# EAGLE design shieldie-xbee (EAGLE 6.4)
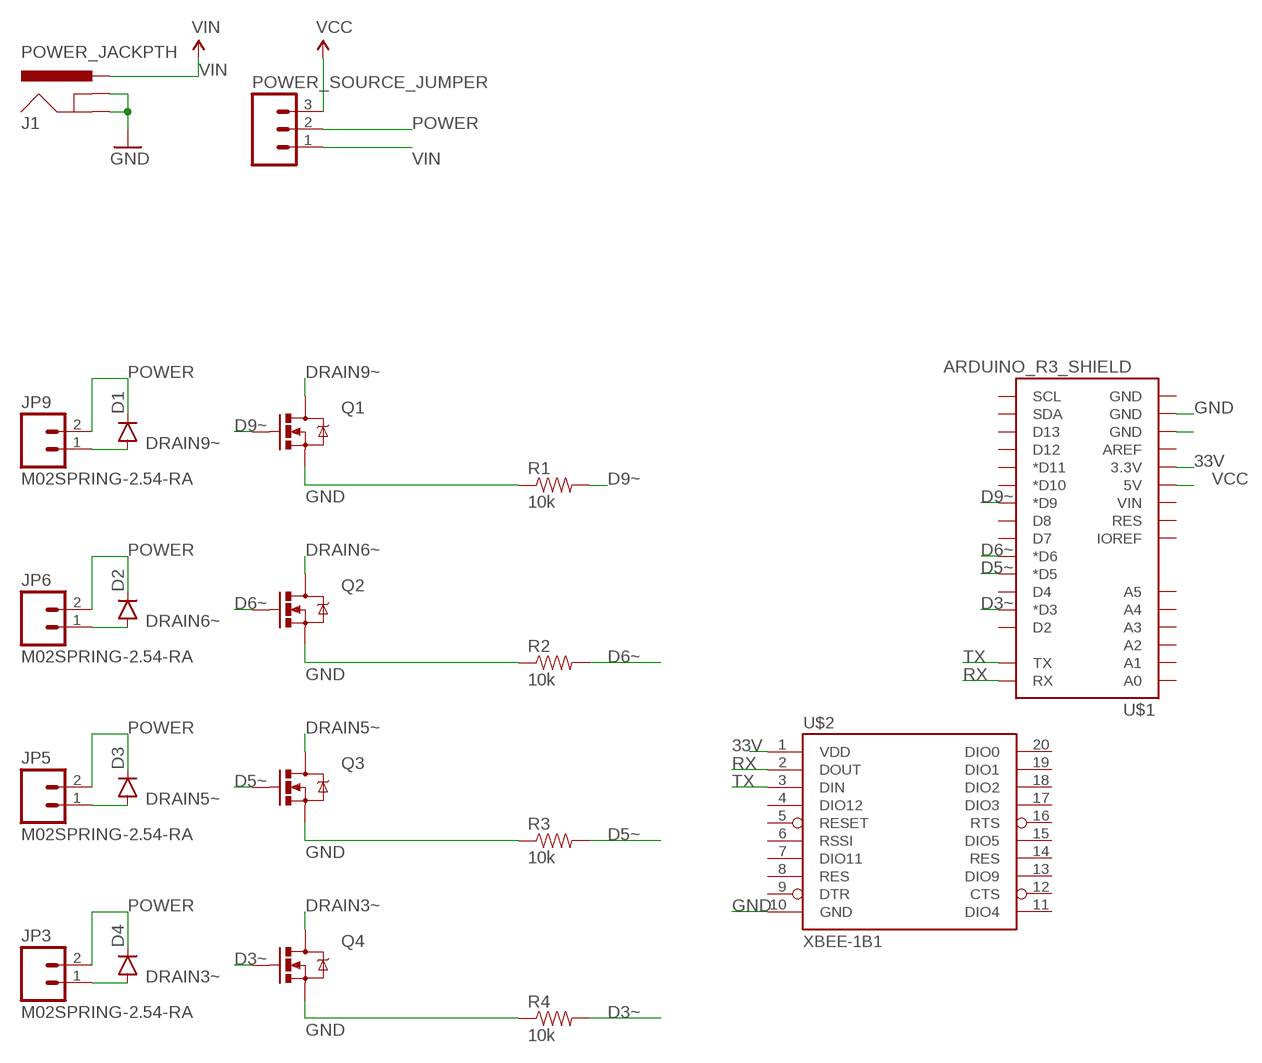
[diagram p0: schematic, sheet 1]

## Parts
D1  DIODEPTH  [DIODE-1N4001]
D2  DIODEPTH  [DIODE-1N4001]
D3  DIODEPTH  [DIODE-1N4001]
D4  DIODEPTH  [DIODE-1N4001]
J1  POWER_JACKPTH  [POWER_JACK_PTH]
JP3  M02SPRING-2.54-RA  [SPRINGTERMINAL-2.54MM-2]
JP5  M02SPRING-2.54-RA  [SPRINGTERMINAL-2.54MM-2]
JP6  M02SPRING-2.54-RA  [SPRINGTERMINAL-2.54MM-2]
JP9  M02SPRING-2.54-RA  [SPRINGTERMINAL-2.54MM-2]
POWER_SOURCE_JUMPER  M03JST-PTH-VERT  [JST-3-PTH-VERT]
Q1  MOSFET-NCHANNELFQP30N06L  [TO220V]
Q2  MOSFET-NCHANNELFQP30N06L  [TO220V]
Q3  MOSFET-NCHANNELFQP30N06L  [TO220V]
Q4  MOSFET-NCHANNELFQP30N06L  [TO220V]
R1  10k  10KOHM-1/4W5%(PTH)  [AXIAL-0.3]
R2  10k  10KOHM-1/4W5%(PTH)  [AXIAL-0.3]
R3  10k  10KOHM-1/4W5%(PTH)  [AXIAL-0.3]
R4  10k  10KOHM-1/4W5%(PTH)  [AXIAL-0.3]
U$1  ARDUINO_R3_SHIELD  [UNO_R3_SHIELD]
U$2  XBEE-1B1  [XBEE-1]

## Nets
33V: U$1.3.3V U$2.1(VDD)
D3~: Q4.1(G) R4.P$2 U$1.D3(*D3)
D5~: Q3.1(G) R3.P$2 U$1.D5(*D5)
D6~: Q2.1(G) R2.P$2 U$1.D6(*D6)
D9~: Q1.1(G) R1.P$2 U$1.D9(*D9)
DRAIN3~: D4.A JP3.1 Q4.2(D)
DRAIN5~: D3.A JP5.1 Q3.2(D)
DRAIN6~: D2.A JP6.1 Q2.2(D)
DRAIN9~: D1.A JP9.1 Q1.2(D)
GND: J1.GND J1.GNDBREAK Q1.3(S) Q2.3(S) Q3.3(S) Q4.3(S) R1.P$1 R2.P$1 R3.P$1 R4.P$1 U$1.GND@1(GND) U$1.GND@2(GND) U$2.10(GND)
POWER: D1.C D2.C D3.C D4.C JP3.2 JP5.2 JP6.2 JP9.2 POWER_SOURCE_JUMPER.2
RX: U$1.RX U$2.2(DOUT)
TX: U$1.TX U$2.3(DIN)
VCC: POWER_SOURCE_JUMPER.3 U$1.5V
VIN: J1.PWR POWER_SOURCE_JUMPER.1
Unconnected: U$1.A0 U$1.A1 U$1.A2 U$1.A3 U$1.A4 U$1.A5 U$1.AREF U$1.D2 U$1.D4 U$1.D7 U$1.D8 U$1.D10(*D10) U$1.D11(*D11) U$1.D12 U$1.D13 U$1.GND@0(GND) U$1.IOREF U$1.RES U$1.SCL U$1.SDA U$1.VIN U$2.4(DIO12) U$2.5(RESET) U$2.6(RSSI) U$2.7(DIO11) U$2.8(RES) U$2.9(DTR) U$2.11(DIO4) U$2.12(CTS) U$2.13(DIO9) U$2.14(RES) U$2.15(DIO5) U$2.16(RTS) U$2.17(DIO3) U$2.18(DIO2) U$2.19(DIO1) U$2.20(DIO0)

## Library data of the parts
D1-D4 = SparkFun-DiscreteSemi:DIODE: Diode These are standard reverse protection diodes and small signal diodes. SMA package can handle up to about 1A. SOD-323 can handle about 200mA. What the SOD-323 package when ordering, there are some mfgs out there that are 5-pin packages.
J1 = SparkFun-Connectors:POWER_JACK: Power Jack This is the standard 5.5mm barrel jack for power. The PTH is the most common, proven, reliable, footprint. The Slot footprint only works if the mill layer is transmitted to the PCB fab house so be warned. Mating wall wart : TOL-00298 (and others); PROD_ID: PRT-00119
JP3 JP5 JP6 JP9 = SparkFun-Connectors:M02: Standard 2-pin 0.1" header. Use with - straight break away headers ( PRT-00116) - right angle break away headers (PRT-00553) - swiss pins (PRT-00743) - machine pins (PRT-00117) - female headers (PRT-00115) Molex polarized connector foot print use with: PRT-08233 with associated crimp pins and housings. 2.54_SCREWTERM for use with PRT-10571. 3.5mm Screw Terminal footprints for PRT-08084 5mm Screw Terminal footprints for use with PRT-08432
POWER_SOURCE_JUMPER = SparkFun-Connectors:M03: Header 3 Standard 3-pin 0.1" header. Use with straight break away headers (SKU : PRT-00116), right angle break away headers (PRT-00553), swiss pins (PRT-00743), machine pins (PRT-00117), and female headers (PRT-00115). Molex polarized connector foot print use with SKU : PRT-08232 with associated crimp pins and housings.
Q1-Q4 = SparkFun-DiscreteSemi:MOSFET-NCHANNEL: Common NMOSFET Parts MFG P/N Store ID Prod ID FDD8780 TRANS-09984 SI7820DN TRANS-11055 FDS6630A IC-08089 2N7002PW TRANS-11151 FQP30N06L COM-10213 TRANS-10060 BSS123LT1G TRANS-08345 BSS138 TRANS-00830 BS170 2N7000; PROD_ID: TRANS-10060
R1-R4 = SparkFun-Resistors:10KOHM-1/4W5%(PTH): RES-09435; PROD_ID: RES-9435
U$1 = SparkFun-Boards:ARDUINO_R3_SHIELD: Shield form compatible with the Arduino Uno R3.
U$2 = SparkFun-RF:XBEE-1: Xbee module footprints SMT header is CONN-09042.

## Board
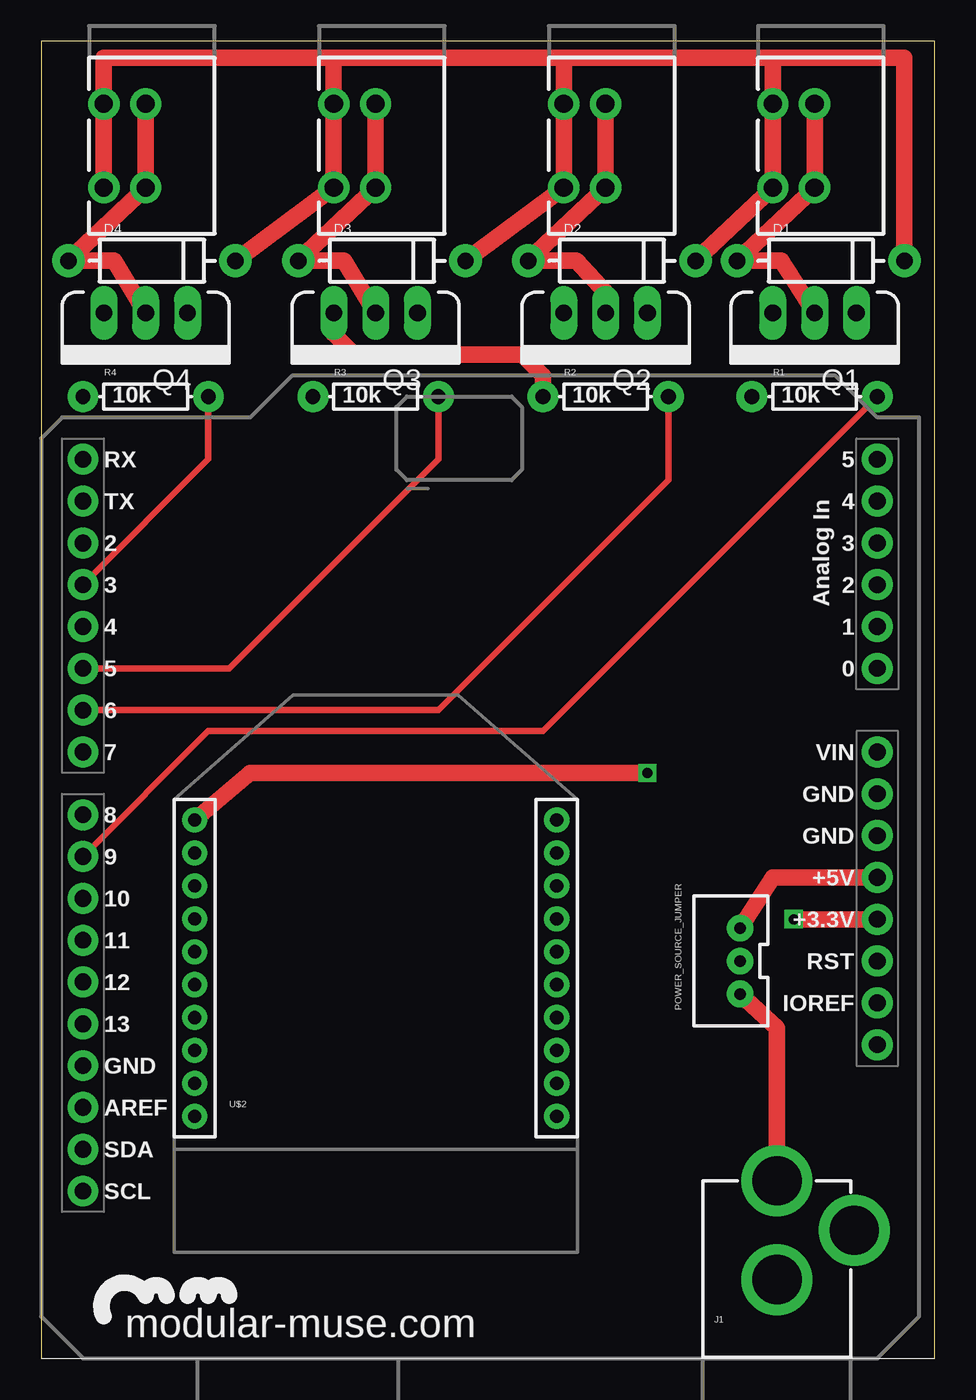
[diagram p1: board, top side]
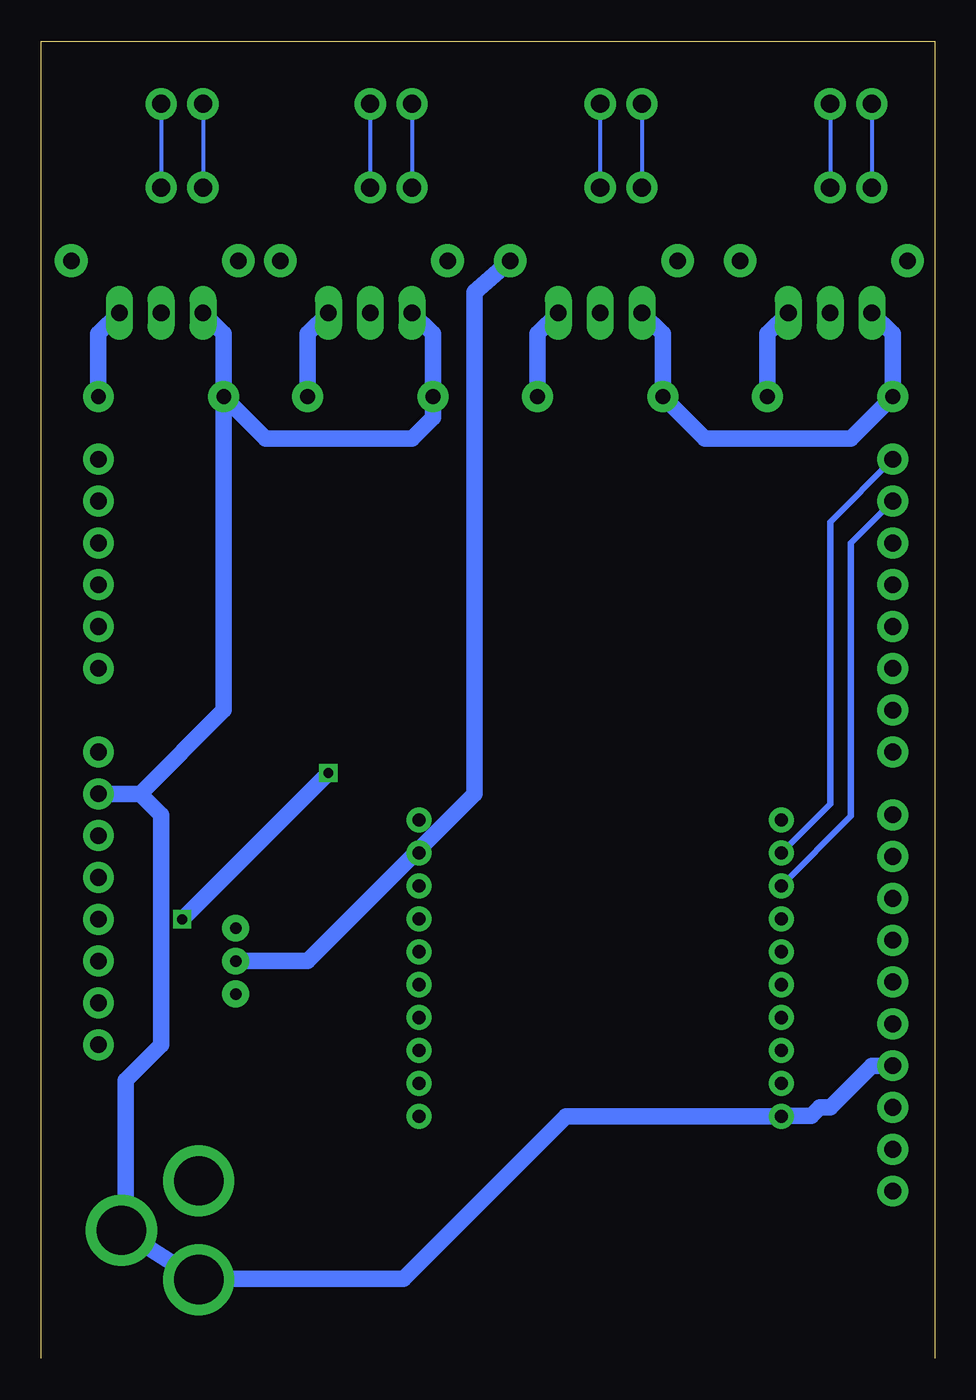
[diagram p2: board, bottom side, seen from below]

Size 54.28 x 80 mm. Coordinates in mm from the lower left corner, seen from the top.
Outline: 54.28,0 54.28,80 0,80 0,0
Copper layers (1*16): Top 0.035mm / dielectric 1.5mm / Bottom 0.035mm
Design rules "SparkFun": minimum track width 8mil, minimum drill 20mil, track to track 8mil, track to pad 8mil, pad to pad 8mil, via to via 8mil, smd to smd 8mil, copper to edge 8mil, drill to drill 8mil, minimum pad ring 12mil, minimum via ring 10mil, stop-mask expansion 4mil, vias tented up to drill 20mil, thermal gap 10mil

### Footprints (pad centres in the part's own frame; a part is rotated, then mirrored left to right if it is on the bottom)
DIODE-1N4001 = drill 1 pad 1.981: A -5.08,0; C 5.08,0
POWER_JACK_PTH = drill 2.997 pad 4.318: GND 0,7.7; GNDBREAK 4.7,10.7; PWR 0,13.7
SPRINGTERMINAL-2.54MM-2 = drill 1.1 pad 1.9: 1 0,0; 2 2.54,0; P$2 0,5.08; P$3 2.54,5.08
JST-3-PTH-VERT = drill 0.7 pad 1.626: 1 -2,-0.55; 2 0,-0.55; 3 2,-0.55
TO220V = drill 1.016 long: 1 -2.54,0; 2 0,0; 3 2.54,0
AXIAL-0.3 = drill 0.9 pad 1.88: P$1 -3.81,0; P$2 3.81,0
UNO_R3_SHIELD = drill 1.016 pad 1.88: 3.3V 50.8,26.67; 5V 50.8,29.21; A0 50.8,41.91; A1 50.8,44.45; A2 50.8,46.99; A3 50.8,49.53; A4 50.8,52.07; A5 50.8,54.61; AREF 2.54,15.24; D2 2.54,49.53; D3 2.54,46.99; D4 2.54,44.45; D5 2.54,41.91; D6 2.54,39.37; D7 2.54,36.83; D8 2.54,33.02; D9 2.54,30.48; D10 2.54,27.94; D11 2.54,25.4; D12 2.54,22.86; D13 2.54,20.32; GND@0 50.8,31.75; GND@1 50.8,34.29; GND@2 2.54,17.78; IOREF 50.8,21.59; NC 50.8,19.05; RES 50.8,24.13; RX 2.54,54.61; SCL 2.54,10.16; SDA 2.54,12.7; TX 2.54,52.07; VIN 50.8,36.83
XBEE-1 = drill 0.8 pad 1.524: 1 -11,20; 2 -11,18; 3 -11,16; 4 -11,14; 5 -11,12; 6 -11,10; 7 -11,8; 8 -11,6; 9 -11,4; 10 -11,2; 11 11,2; 12 11,4; 13 11,6; 14 11,8; 15 11,10; 16 11,12; 17 11,14; 18 11,16; 19 11,18; 20 11,20

### Placement (x,y rotation side)
D1  47.37,66.67 0 top
D2  34.67,66.67 0 top
D3  20.7,66.67 0 top
D4  6.73,66.67 0 top
J1  44.7,-2.92 0 top
JP3  6.35,76.2 180 top
JP5  20.32,76.2 180 top
JP6  34.29,76.2 180 top
JP9  46.99,76.2 180 top
POWER_SOURCE_JUMPER  41.91,24.13 90 top
Q1  46.99,63.5 180 top
Q2  34.29,63.5 180 top
Q3  20.32,63.5 180 top
Q4  6.35,63.5 180 top
R1  46.99,58.42 0 top
R2  34.29,58.42 0 top
R3  20.32,58.42 0 top
R4  6.35,58.42 0 top
U$1  0,0 0 top
U$2  20.32,12.7 0 top

### Tracks (layer width: path | path; a pad name or v marks a point on that pad's centre or on a via)
33V  (via drill 0.6)
  Top 1.016: U$1.3.3V v45.72,26.67 | v36.83,35.56 12.7,35.56 U$2.1
  Bottom 1.016: v45.72,26.67 v36.83,35.56
D3~
  Top 0.406: U$1.D3 10.16,54.61 R4.P$2
  Bottom 1.016: Q4.1 10.16,62.23 R4.P$2
D5~
  Top 0.406: U$1.D5 11.43,41.91 24.13,54.61 R3.P$2
  Bottom 1.016: Q3.1 24.13,62.23 R3.P$2
D6~
  Top 0.406: U$1.D6 24.13,39.37 38.1,53.34 R2.P$2
  Bottom 1.016: Q2.1 38.1,62.23 R2.P$2
D9~
  Top 0.406: U$1.D9 10.16,38.1 30.48,38.1 R1.P$2
  Bottom 1.016: Q1.1 50.8,62.23 R1.P$2
DRAIN3~
  Top 1.016: JP3.1 6.35,71.12 D4.A 4.45,66.67 Q4.2
DRAIN5~
  Top 1.016: JP5.1 20.32,71.12 D3.A 18.41,66.67 Q3.2
DRAIN6~
  Top 1.016: JP6.1 34.29,71.12 D2.A 32.51,66.67 34.29,64.77 Q2.2
DRAIN9~
  Top 1.016: JP9.1 46.99,71.12 D1.A 44.96,66.67 Q1.2
GND
  Top 1.016: Q3.3 17.78,62.23 19.05,60.96 29.21,60.96 30.48,59.69 R2.P$1
  Bottom 1.016: U$1.GND@1 48.26,34.29 | 48.26,34.29 43.18,39.37 R1.P$1 | 48.26,34.29 46.99,33.02 46.99,19.05 49.15,16.89 49.15,8.26 J1.GNDBREAK J1.GND 44.66,4.83 32.26,4.83 22.38,14.7 U$2.10 9.29,14.73 7.49,14.73 6.99,15.24 6.35,15.24 3.81,17.78 U$1.GND@2 | Q1.3 43.18,62.23 R1.P$1 | Q2.3 30.48,62.23 R2.P$1 30.48,57.15 31.75,55.88 40.64,55.88 R1.P$1 | Q3.3 16.51,62.23 R3.P$1 13.97,55.88 5.08,55.88 R4.P$1 2.54,62.23 Q4.3
POWER
  Top 1.016: D1.C 52.45,78.99 44.45,78.99 | 44.45,78.99 31.75,78.99 | 31.75,78.99 17.78,78.99 | 17.78,78.99 3.81,78.99 3.81,71.12 | 17.78,78.99 17.78,71.12 D4.C | 31.75,78.99 31.75,71.12 D3.C | 44.45,78.99 44.45,71.12 D2.C
  Bottom 1.016: POWER_SOURCE_JUMPER.2 38.1,24.13 27.94,34.29 27.94,64.77 D3.C
RX
  Bottom 0.406: U$1.RX 6.35,50.8 6.35,33.67 U$2.2
TX
  Bottom 0.406: U$1.TX 5.08,49.53 5.08,32.94 U$2.3
VCC
  Top 1.016: U$1.5V 44.45,29.21 POWER_SOURCE_JUMPER.3
VIN
  Top 1.016: POWER_SOURCE_JUMPER.1 44.7,20.07 J1.PWR

### Text on the board
tPlace: modular-muse.com